# Altium schematic sheet Motors.SchDoc: Motors
size Letter; DocumentNumber: 3; SheetNumber: 3; SheetTotal: 8
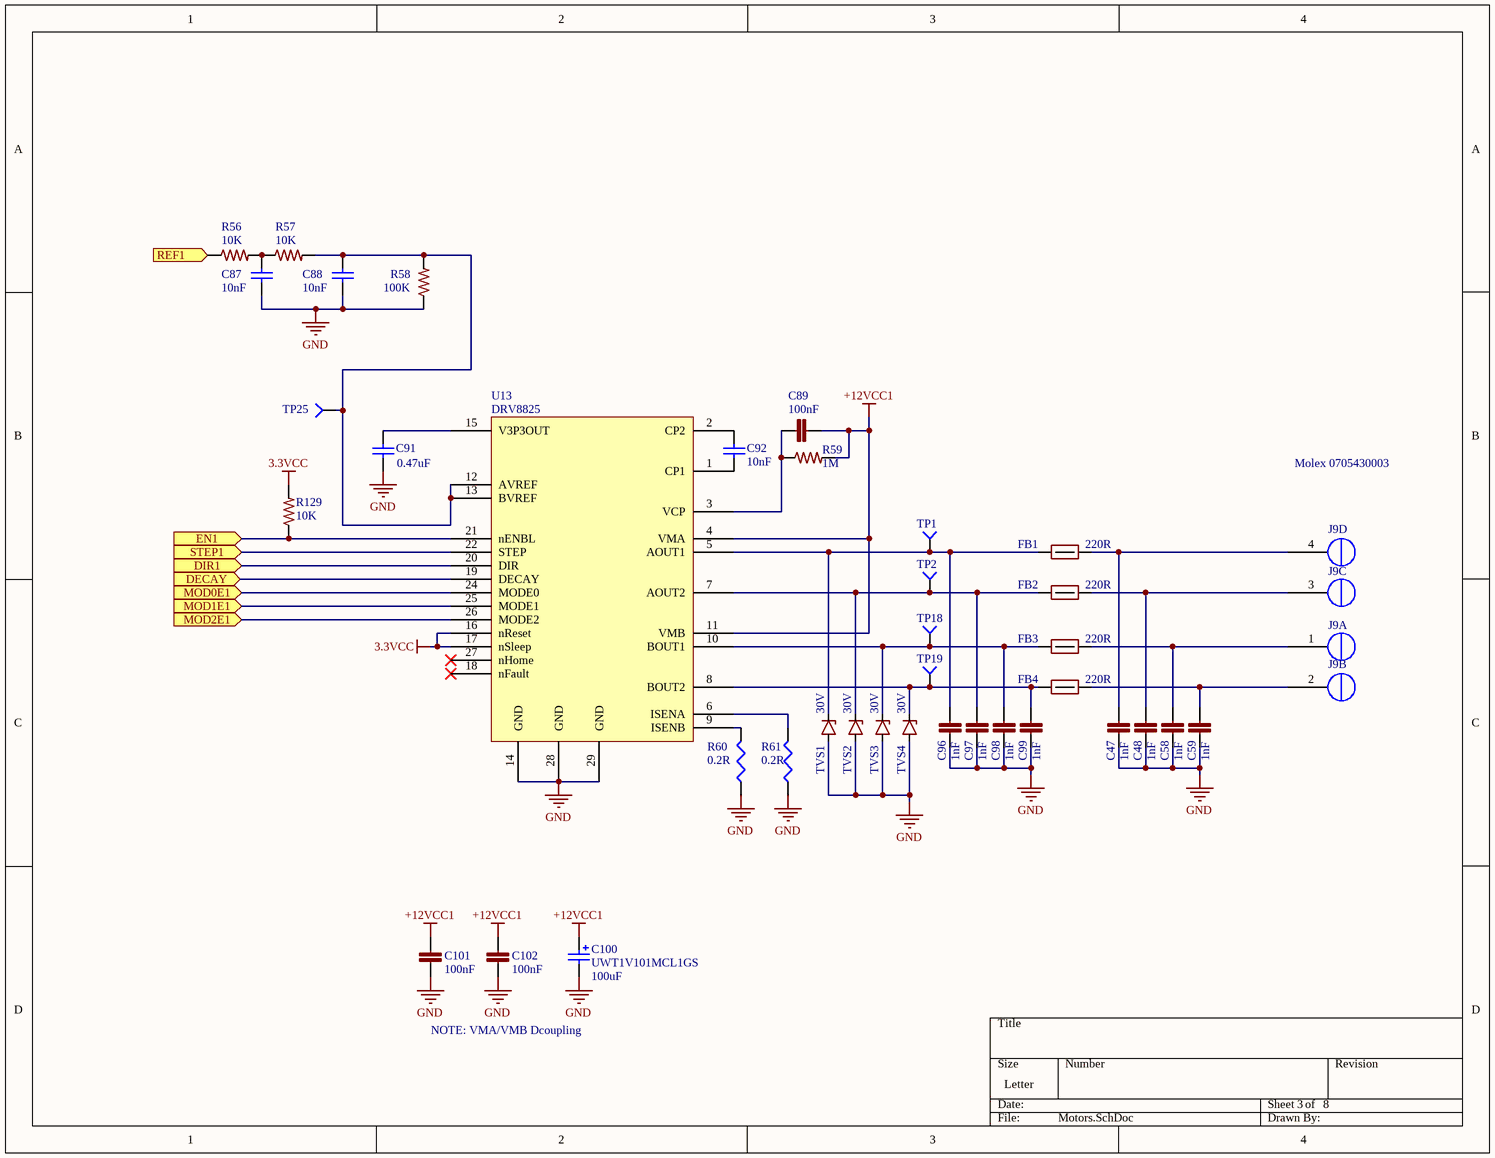
[diagram p0: Motors.SchDoc]

## Parts
C47  1nF  [C0402]
C48  1nF  [C0402]
C58  1nF  [C0402]
C59  1nF  [C0402]
C87  10nF  [C0402]
C88  10nF  [C0402]
C89  100nF  [C0402]
C91  value 0.47uF  [C0402]  (hidden comment: 0402)
C92  10nF  [C0402]
C96  1nF  [C0402]
C97  1nF  [C0402]
C98  1nF  [C0402]
C99  1nF  [C0402]
C100  UWT1V101MCL1GS  value 100uF  [CAP-ELEC-063063077]
C101  100nF  [C0603]
C102  100nF  [C0603]
FB1  220R  [FB0603]
FB2  220R  [FB0603]
FB3  220R  [FB0603]
FB4  220R  [FB0603]
J9  Molex 0705430003  [4POL254]  (parts A,B,C,D of 4)
R56  10K  [R0402]
R57  10K  [R0402]
R58  100K  [R0402]
R59  1M  [R0402]
R60  value 0.2R  [2512R-0.55]  (hidden comment: 2512)
R61  value 0.2R  [2512R-0.55]  (hidden comment: 2512)
R129  10K  [R0402]
TP1  TP4  [TP-2]  (value not drawn)
TP2  TP4  [TP-2]  (value not drawn)
TP18  TP4  [TP-2]  (value not drawn)
TP19  TP4  [TP-2]  (value not drawn)
TP25  TP4  [TP-2]  (value not drawn)
TVS1  value 30V  [SMF]  (hidden comment: TVS 30V SMF)
TVS2  value 30V  [SMF]  (hidden comment: TVS 30V SMF)
TVS3  value 30V  [SMF]  (hidden comment: TVS 30V SMF)
TVS4  value 30V  [SMF]  (hidden comment: TVS 30V SMF)
U13  DRV8825  [DRV8825PWPR]

## Ports
DECAY, DIR1, EN1, MOD0E1, MOD1E1, MOD2E1, REF1, STEP1

## Nets
3.3VCC: R129.2 U13.16(nReset) U13.17(nSleep)
+12VCC1: C89.2 C100.1 C101.1 C102.1 R59.2 U13.4(VMA) U13.11(VMB)
GND: C47.2 C48.2 C58.2 C59.2 C87.1 C88.1 C91.1 C96.2 C97.2 C98.2 C99.2 C100.2 C101.2 C102.2 R58.1 R60.1 R61.1 TVS1.A TVS2.A TVS3.A TVS4.A U13.14(GND) U13.28(GND) U13.29(GND)
DECAY: U13.19(DECAY) ; port DECAY
DIR1: U13.20(DIR) ; port DIR1
EN1: R129.1 U13.21(nENBL) ; port EN1
MOD0E1: U13.24(MODE0) ; port MOD0E1
MOD1E1: U13.25(MODE1) ; port MOD1E1
MOD2E1: U13.26(MODE2) ; port MOD2E1
REF1: R56.1 ; port REF1
STEP1: U13.22(STEP) ; port STEP1
NetC47_1: C47.1 FB1.2 J9.4(OUT1B)
NetC48_1: C48.1 FB2.2 J9.3(OUT1A)
NetC58_1: C58.1 FB3.2 J9.1(OUT2B)
NetC59_1: C59.1 FB4.2 J9.2(OUT2A)
NetC87_2: C87.2 R56.2 R57.1
NetC88_2: C88.2 R57.2 R58.2 TP25.1 U13.12(AVREF) U13.13(BVREF)
NetC89_1: C89.1 R59.1 U13.3(VCP)
NetC91_2: C91.2 U13.15(V3P3OUT)
NetC92_1: C92.1 U13.1(CP1)
NetC92_2: C92.2 U13.2(CP2)
NetC96_1: C96.1 FB1.1 TP1.1 TVS1.K U13.5(AOUT1)
NetC97_1: C97.1 FB2.1 TP2.1 TVS2.K U13.7(AOUT2)
NetC98_1: C98.1 FB3.1 TP18.1 TVS3.K U13.10(BOUT1)
NetC99_1: C99.1 FB4.1 TP19.1 TVS4.K U13.8(BOUT2)
NetR60_2: R60.2 U13.9(ISENB)
NetR61_2: R61.2 U13.6(ISENA)

Not connected (* = marked no-connect by the designer): U13 18(nFault)* 23(NC) 27(nHome)*

## Notes on the sheet
- NOTE: VMA/VMB Dcoupling

## Library data of the parts
C47 C48 C58 C59 C96-C99 = CAP 1nF 50V 0402 X7R: 1000pF 50V Ceramic Capacitor X7R 0402 (1005 Metric) 0.039" L x 0.020" W (1.00mm x 0.50mm); ManufacturerPartNumber: GRM155R71H102KA01D; LastRevisionNote: ImportComponents; Published: 23-Apr-2014; Publisher: UltiMachine; LastRevisionDate: 23-Apr-2014; VALUE: 1nF
C87 C88 C92 = GRM155R71H103JA88D: CAP CER 10nF 50V X7R 0402; MFR: Murata; Part Description: CAP CER 10000PF 50V X7R 0402; Tolerance: 10%; Voltage: 6.3VDC; Value: 0.01uF 50V; Published: 10 - Dec - 2014; LatestRevisionDate: 10 - Dec - 2014; LatestRevisionNote: Ultimachine Footprint Added; Publisher: Ultimachine; Component Type: Chip Capacitor; MFR Part #: GRM155R71H103JA88D; Mounting Type: SMT 0402; Datasheet: http://search.murata.co.jp/Ceramy/image/img/A01X/G101/ENG/GRM155R71H103JA88-01.pdf; Height: 0.5 ±0.05mm; Digikey #: 490-7763-1-ND; PackageReference: 0402
C89 = GRM155R71C104KA88D: CAP CER 0402 100nF 16V 10% X7R; LastRevisionNote: ImportComponents; Published: 23-Apr-2014; Publisher: UltiMachine; LastRevisionDate: 23-Apr-2014; ManufacturerPartNumber: GRM155R71C104KA88D; VALUE: 100nF
C91 = GRM155R60J474KE19D: 0.47uF 6.3v C0402 - GRM155R60J474KE19D; MFR: Murata; Part Description: CAP CER 0.47UF 6.3V 10% X5R 0402; Tolerance: 10%; Voltage: 6.3VDC; Published: 10 - Dec - 2014; LatestRevisionDate: 10 - Dec - 2014; LatestRevisionNote: Ultimachine Footprint Added; Publisher: Ultimachine; Component Type: Chip Capacitor; MFR Part #: GRM155R60J474KE19D; Mounting Type: SMT 0402; Datasheet: http://search.murata.co.jp/Ceramy/image/img/A01X/G101/ENG/GRM155R60J474KE19-01.pdf; Height: 0.5 ±0.05mm; PackageReference: 0402
C100 = UWT1V101MCL1GS: CAP ALUM 100UF 35V 20% SMD; Status: Active; Height: 7.70mm; Manufacture Part #: UWT1V101MCL1GS
C101 C102 = C0603C104K5RACTU: CAP CER 0603 100nF 50V 10% X7R; LastRevisionNote: ImportComponents; Published: 23-Apr-2014; Publisher: UltiMachine; LastRevisionDate: 23-Apr-2014; ManufacturerPartNumber: C0603C104K5RACTU; VALUE: 100nF
FB1-FB4 = FERRITE 220R 2.5A 0603: FERRITE BEAD 220 OHM 0603 1LN; Manufacturer: Samsung; ManufacturerPartNumber: CIS10P221NC; LastRevisionNote: ImportComponents; Published: 23-Apr-2014; Publisher: UltiMachine; LastRevisionDate: 23-Apr-2014; Value: 220R
J9 = Molex 0705430003 Alt: Molex 4 Pin Clip Connector
R56 R57 R129 = RC0402FR-0710KP: RES SMD 10K OHM 1% 1/16W 0402; LastRevisionNote: ImportComponents; Published: 23-Apr-2014; Publisher: UltiMachine; LastRevisionDate: 23-Apr-2014; ManufacturerPartNumber: RC0402FR-0710KP; VALUE: 10K
R58 = RC1005F104CS: RES SMD 100K OHM 1% 1/16W 0402; Manufacturer: Samsung; LastRevisionNote: ImportComponents; Digilkey #: 1276-3432-1-ND; Published: 23-Apr-2014; Publisher: UltiMachine; LastRevisionDate: 23-Apr-2014; ManufacturerPartNumber: RC1005F104CS; VALUE: 100K
R59 = ERJ2GEJ105X: RES 0402 1M 100mW 5%; LastRevisionNote: ImportComponents; Published: 23-Apr-2014; Publisher: UltiMachine; LastRevisionDate: 23-Apr-2014; ManufacturerPartNumber: ERJ2GEJ105X; VALUE: 1M
R60 R61 = CSRN2512FTR200: RES SMD 0.2 OHM 1% 2W 2512; MFR: Stackpole ELectronics Inc; MFR #: CSRN2512FTR100; PackageReference: 2512; Digikey #: CSRN2512FTR100TR-ND; PDF: http://www.seielect.com/catalog/SEI-CSR_CSRN.pdf
TP1 TP2 TP18 TP19 TP25 = Socket: LatestRevisionDate: 17-Jul-2002; LatestRevisionNote: Re-released for DXP Platform.; Publisher: Altium Limited
TVS1-TVS4 = TVS 30V SMF: TVS DIODE 30VWM 48.4VC SMF; ManufacturerPartNumber: SMF30A-E3-08; LastRevisionNote: ImportComponents; Published: 23-Apr-2014; Publisher: UltiMachine; LastRevisionDate: 23-Apr-2014
U13 = DRV8825: DRV8825 Ti Stepper Driver; Manufacture: Texas Instruments; Mountining Type: SMD - Ti PowerPAD Package; Voltage: 8.2-45VDC; Cost (1000 qty): 2.25; Part Number: DRV8825PWPR; Status: In-Production; Pins: 28 Pins and one Exposed Pad; Datasheet: http://www.ti.com/lit/gpn/drv8825; Height: 1.2mm; Tolerance: N/A; Type: Stepper Driver - Integrated Circuit; Lead Free: YES